# EAGLE design Saturn (EAGLE 9.6.2)
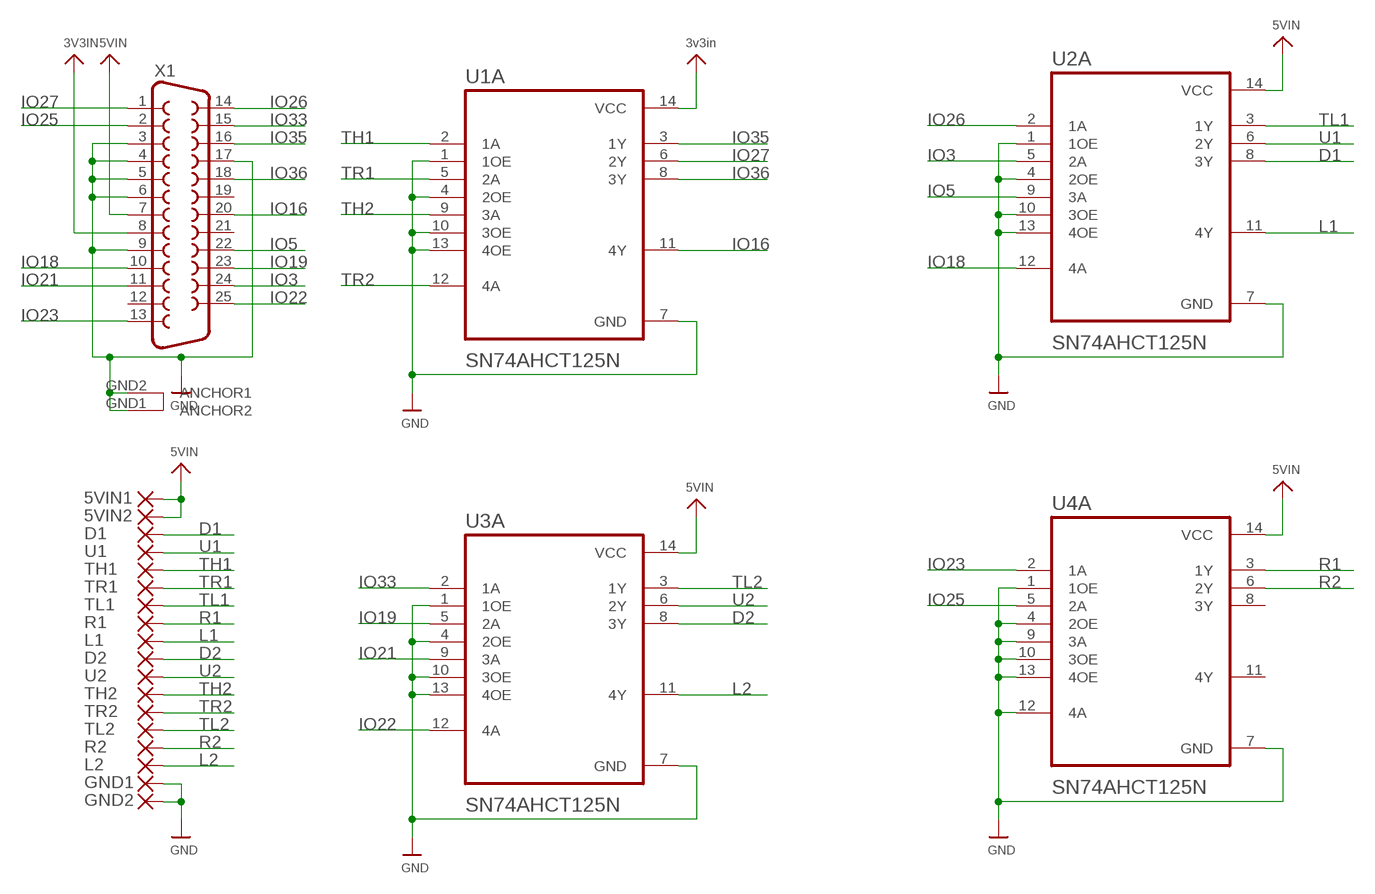
[diagram p0: schematic, sheet 1]

## Parts
5VIN1  SMD5  [SMD2,54-5,08]
5VIN2  SMD5  [SMD2,54-5,08]
D1  SMD5  [SMD2,54-5,08]
D2  SMD5  [SMD2,54-5,08]
GND1  SMD5  [SMD2,54-5,08]
GND2  SMD5  [SMD2,54-5,08]
L1  SMD5  [SMD2,54-5,08]
L2  SMD5  [SMD2,54-5,08]
R1  SMD5  [SMD2,54-5,08]
R2  SMD5  [SMD2,54-5,08]
TH1  SMD5  [SMD2,54-5,08]
TH2  SMD5  [SMD2,54-5,08]
TL1  SMD5  [SMD2,54-5,08]
TL2  SMD5  [SMD2,54-5,08]
TR1  SMD5  [SMD2,54-5,08]
TR2  SMD5  [SMD2,54-5,08]
U1  SMD5  [SMD2,54-5,08]
U1A  SN74AHCT125N  [DIP794W45P254L1969H508Q14]
U2  SMD5  [SMD2,54-5,08]
U2A  SN74AHCT125N  [DIP794W45P254L1969H508Q14]
U3A  SN74AHCT125N  [DIP794W45P254L1969H508Q14]
U4A  SN74AHCT125N  [DIP794W45P254L1969H508Q14]
X1  DB25_FEMALEHP  [F25HP]

## Nets
3V3IN: U1A.14(VCC) X1.8 ; supply symbol labelled 3v3in
5VIN: 5VIN1.1(P) 5VIN2.1(P) U2A.14(VCC) U3A.14(VCC) U4A.14(VCC) X1.7
D1: D1.1(P) U2A.8(3Y)
D2: D2.1(P) U3A.8(3Y)
GND: GND1.1(P) GND2.1(P) U1A.1(1OE) U1A.4(2OE) U1A.7(GND) U1A.10(3OE) U1A.13(4OE) U2A.1(1OE) U2A.4(2OE) U2A.7(GND) U2A.10(3OE) U2A.13(4OE) U3A.1(1OE) U3A.4(2OE) U3A.7(GND) U3A.10(3OE) U3A.13(4OE) U4A.1(1OE) U4A.4(2OE) U4A.7(GND) U4A.9(3A) U4A.10(3OE) U4A.12(4A) U4A.13(4OE) X1.3 X1.4 X1.5 X1.6 X1.9 X1.17 X1.GND1(ANCHOR2) X1.GND2(ANCHOR1)
IO3: U2A.5(2A) X1.24
IO5: U2A.9(3A) X1.22
IO16: U1A.11(4Y) X1.20
IO18: U2A.12(4A) X1.10
IO19: U3A.5(2A) X1.23
IO21: U3A.9(3A) X1.11
IO22: U3A.12(4A) X1.25
IO23: U4A.2(1A) X1.13
IO25: U4A.5(2A) X1.2
IO26: U2A.2(1A) X1.14
IO27: U1A.6(2Y) X1.1
IO33: U3A.2(1A) X1.15
IO35: U1A.3(1Y) X1.16
IO36: U1A.8(3Y) X1.18
L1: L1.1(P) U2A.11(4Y)
L2: L2.1(P) U3A.11(4Y)
R1: R1.1(P) U4A.3(1Y)
R2: R2.1(P) U4A.6(2Y)
TH1: TH1.1(P) U1A.2(1A)
TH2: TH2.1(P) U1A.9(3A)
TL1: TL1.1(P) U2A.3(1Y)
TL2: TL2.1(P) U3A.3(1Y)
TR1: TR1.1(P) U1A.5(2A)
TR2: TR2.1(P) U1A.12(4A)
U1: U1.1(P) U2A.6(2Y)
U2: U2.1(P) U3A.6(2Y)
Unconnected: U4A.8(3Y) U4A.11(4Y) X1.12 X1.19 X1.21

## Library data of the parts
5VIN1 5VIN2 D1 D2 GND1 GND2 L1 L2 R1 R2 TH1 TH2 TL1 TL2 TR1 TR2 U1 U2 = wirepad:SMD5: SMD PAD
U1A U2A U3A U4A = SN74AHCT125N:SN74AHCT125N: None Check prices <https://pricing.snapeda.com/parts/SN74AHCT125N/Texas%20Instruments/view-part?ref=eda>; AVAILABILITY: In Stock; DESCRIPTION: Quadruple Bus Buffer Gates With 3-State Outputs 14-PDIP -40 to 125; MF: Texas Instruments; MP: SN74AHCT125N; PACKAGE: PDIP-14 Texas Instruments; PRICE: None; PURCHASE-URL: https://pricing.snapeda.com/search/part/SN74AHCT125N/?ref=eda
X1 = SparkFun-Retired:DB25_FEMALE: 25 Pin male connector. PCB edge mount for regular PCB thicknesses. This connector will connect directly to the back of a PC parallel port or through a normal DB25 extension cable (M/F). SKU: PRT-08287

## Board
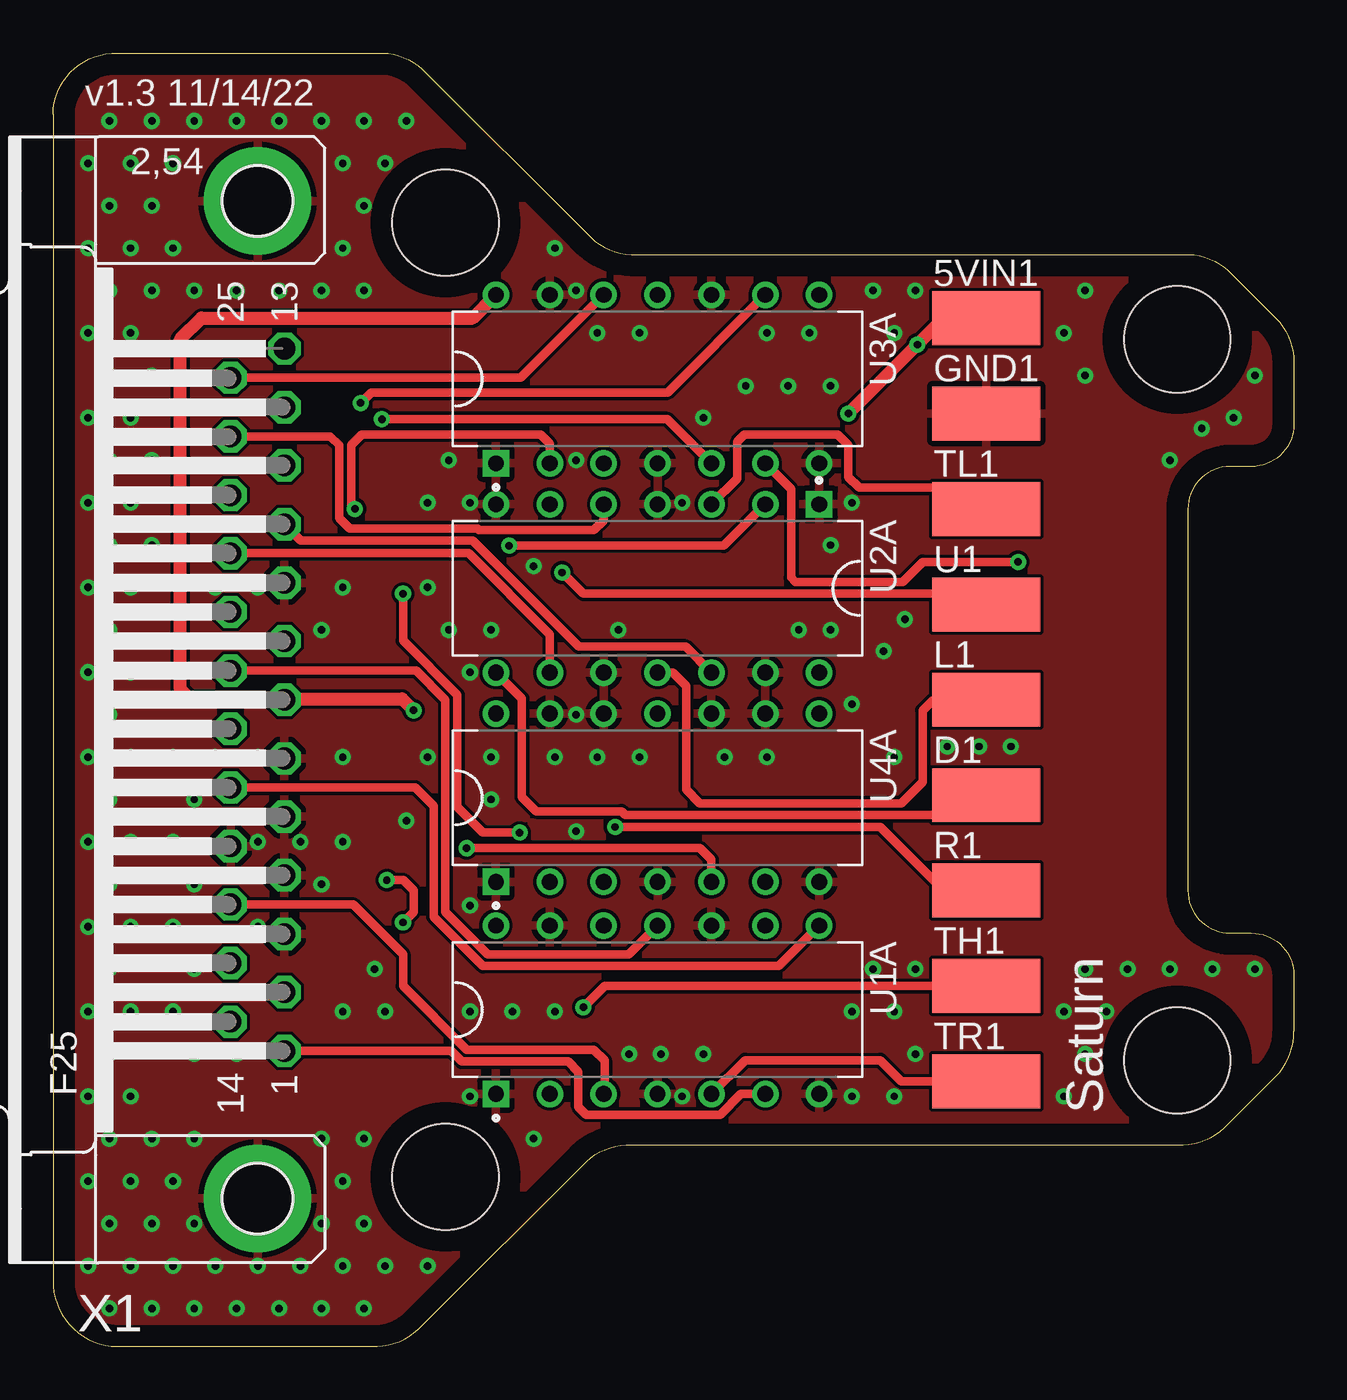
[diagram p1: board, top side]
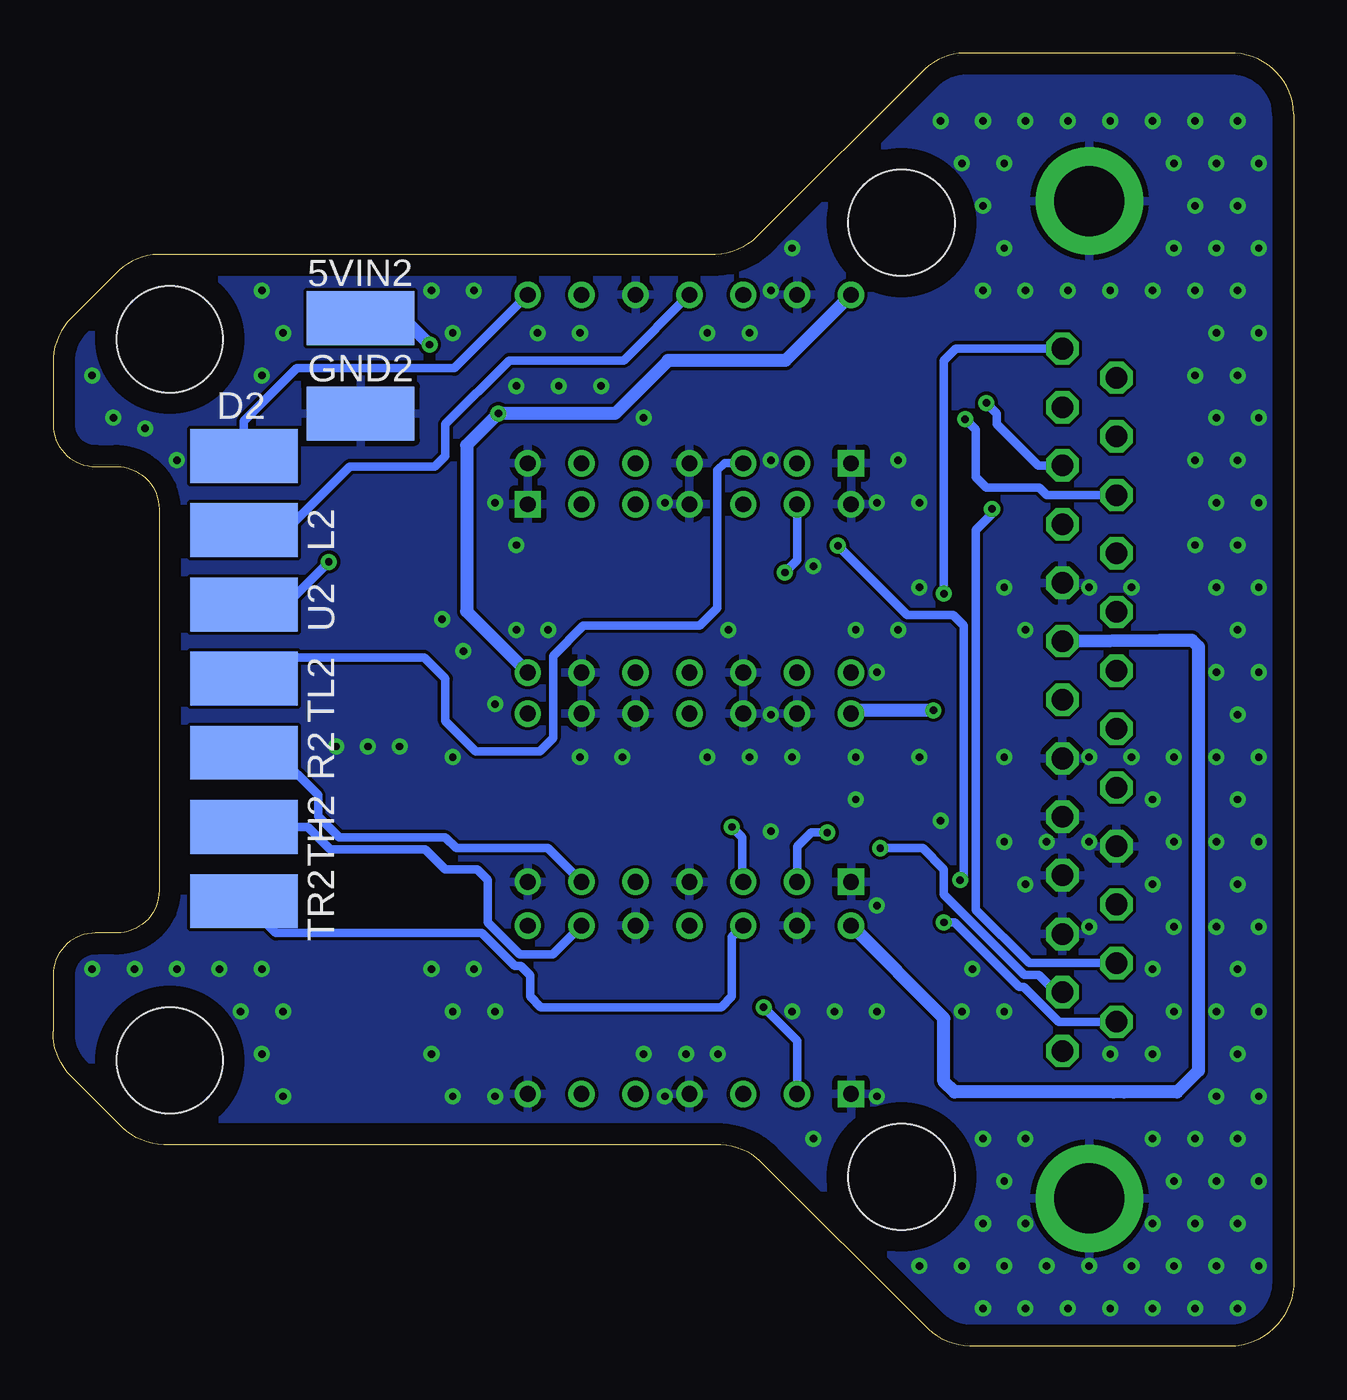
[diagram p2: board, bottom side, seen from below]

Size 58.5 x 61 mm. Coordinates in mm from the lower left corner, seen from the top.
Outline: 0,58.12 0,3.12 arc90 3.03,0 15.29,0 arc45 17.41,1 25.15,8.74 arc-45 27.27,9.5 53.29,9.5 arc45 55.41,10.5 57.65,12.74 arc45 58.5,14.86 58.5,17.5 arc90 56.5,19.5 55.5,19.5 arc-90 53.5,21.5 53.5,39.5 arc-90 55.5,41.5 56.5,41.5 arc90 58.5,43.5 58.5,46.38 arc45 57.65,48.5 55.41,50.74 arc45 53.29,51.5 27.27,51.5 arc-45 25.15,52.5 17.41,60.24 arc45 15.29,61 3.03,61 arc90 0,58.12
Copper layers (1*16): Top 0.035mm / dielectric 1.5mm / Bottom 0.035mm
Design rules "default": minimum track width 6mil, minimum drill 0.35mm, track to track 6mil, track to pad 6mil, pad to pad 6mil, via to via 6mil, smd to smd 6mil, copper to edge 40mil, drill to drill 6mil, minimum pad ring 10mil, minimum via ring 8mil, stop-mask expansion 4mil, vias tented up to drill 0.5mm, thermal gap 10mil
Holes 5 mm at 53,13.5 53,47.5 18.5,53 18.5,8

### Footprints (pad centres in the part's own frame; a part is rotated, then mirrored left to right if it is on the bottom)
SMD2,54-5,08 = smd 2.54 x 5.08: 1 0,0
DIP794W45P254L1969H508Q14 = drill 0.74 pad 1.14 square: 1 -3.97,7.62 | drill 0.74 pad 1.14: 2 -3.97,5.08; 3 -3.97,2.54; 4 -3.97,0; 5 -3.97,-2.54; 6 -3.97,-5.08; 7 -3.97,-7.62; 8 3.97,-7.62; 9 3.97,-5.08; 10 3.97,-2.54; 11 3.97,0; 12 3.97,2.54; 13 3.97,5.08; 14 3.97,7.62
F25HP = drill 1.016 octagon: 1 -16.561,-1.27; 2 -13.792,-1.27; 3 -11.049,-1.27; 4 -8.28,-1.27; 5 -5.512,-1.27; 6 -2.769,-1.27; 7 0,-1.27; 8 2.769,-1.27; 9 5.512,-1.27; 10 8.28,-1.27; 11 11.049,-1.27; 12 13.792,-1.27; 13 16.561,-1.27; 14 -15.189,1.27; 15 -12.421,1.27; 16 -9.652,1.27; 17 -6.909,1.27; 18 -4.14,1.27; 19 -1.372,1.27; 20 1.372,1.27; 21 4.14,1.27; 22 6.909,1.27; 23 9.652,1.27; 24 12.421,1.27; 25 15.189,1.27 | drill 3.302 pad 5.08: GND1 -23.52,0; GND2 23.52,0

### Placement (x,y rotation side)
5VIN1  44,48.5 270 top
5VIN2  44,48.5 270 bottom
D1  44,26 270 top
D2  49.5,42 270 bottom
GND1  44,44 270 top
GND2  44,44 270 bottom
L1  44,30.5 270 top
L2  49.5,38.5 270 bottom
R1  44,21.5 270 top
R2  49.5,28 270 bottom
TH1  44,17 270 top
TH2  49.5,24.5 270 bottom
TL1  44,39.5 270 top
TL2  49.5,31.5 270 bottom
TR1  44,12.5 270 top
TR2  49.5,21 270 bottom
U1  44,35 270 top
U1A  28.5,15.88 90 top
U2  49.5,35 270 bottom
U2A  28.5,35.75 270 top
U3A  28.5,45.63 90 top
U4A  28.5,25.88 90 top
X1  9.64,30.5 90 top

### Tracks (layer width: path | path; a pad name or v marks a point on that pad's centre or on a via)
3V3IN
  Bottom 0.61: X1.8 6.31,33.31 4.81,33.31 4.5,33 4.5,13 5.5,12 8,12 8.5,12 16,12 16.5,12.5 16.5,15.47 U1A.14
5VIN  (via drill 0.35)
  Top 0.61: v17,30 16.46,30.54 10.95,30.54 X1.7 10.87,30.54 6.46,30.54 6,31 6,47.5 7,48.5 19.78,48.5 U3A.14 | 5VIN2.1 42,48.5 v40.75,47.25 v37.5,44
  Bottom 0.61: U3A.14 23.98,46.5 29.5,46.5 32,44 v37.5,44 39,42.5 39,34.66 U2A.14 | v17,30 20.73,30 U4A.14 | 5VIN2.1 42,48.5 v40.75,47.25
D1
  Top 0.406: U2A.8 22.1,30.57 22.1,25.91 22.77,25.23 26.8,25.23 26.98,25.06 43.06,25.06 D1.1
D2
  Bottom 0.406: U3A.8 39.58,46.13 47,46.13 49.5,43.63 D2.1
GND  (via drill 0.35)
  other vias: 2.66,1.8 1.66,3.8 2.66,5.8 1.66,7.8 2.66,9.8 1.66,11.8 2.66,13.8 1.66,15.8 2.66,17.8 1.66,19.8 2.66,21.8 1.66,23.8 2.66,25.8 1.66,27.8 2.66,29.8 1.66,31.8 2.66,33.8 1.66,35.8 2.66,37.8 1.66,39.8 2.66,41.8 1.66,43.8 2.66,45.8 1.66,47.8 2.66,49.8 1.66,51.8 2.66,53.8 1.66,55.8 2.66,57.8 4.66,1.8 3.66,3.8 4.66,5.8 3.66,7.8 4.66,9.8 3.66,11.8 3.66,15.8 3.66,19.8 3.66,23.8 3.66,27.8 3.66,31.8 3.66,35.8 4.66,37.8 3.66,39.8 4.66,41.8 3.66,43.8 4.66,45.8 3.66,47.8 4.66,49.8 3.66,51.8 4.66,53.8 3.66,55.8 4.66,57.8 6.66,1.8 5.66,3.8 6.66,5.8 5.66,7.8 6.66,9.8 6.66,13.8 5.66,15.8 6.66,17.8 5.66,19.8 6.66,21.8 5.66,23.8 6.66,25.8 5.66,27.8 6.66,49.8 5.66,51.8 5.66,55.8 6.66,57.8 8.66,1.8 7.66,3.8 8.66,13.8 7.66,27.8 7.66,35.8 8.66,49.8 8.66,57.8 10.66,1.8 9.66,3.8 9.66,19.8 9.66,23.8 9.66,27.8 9.66,35.8 10.66,49.8 10.66,57.8 12.66,1.8 11.66,3.8 12.66,5.8 12.66,9.8 12.66,21.8 11.66,23.8 12.66,33.8 12.66,49.8 12.66,57.8 14.66,1.8 13.66,3.8 14.66,5.8 13.66,7.8 14.66,9.8 13.66,15.8 15.16,17.8 13.66,23.8 13.66,27.8 13.66,35.8 14.66,49.8 13.66,51.8 14.66,53.8 13.66,55.8 14.66,57.8 15.66,3.8 15.66,15.8 16.66,24.8 15.66,55.8 16.66,57.8 17.66,3.8 17.66,27.8 18.66,33.8 17.66,35.8 17.66,39.8 18.66,41.8 19.66,11.8 19.66,15.8 19.66,20.8 20.66,25.8 20.66,27.8 19.66,31.8 20.66,33.8 19.66,39.8 22.66,9.8 21.66,15.8 23.66,15.8 40.16,34.3 24.66,24.3 23.66,27.8 24.66,29.8 22.66,36.8 24.66,41.8 24.66,49.8 23.66,51.8 27.16,13.8 25.66,27.8 26.66,33.8 25.66,47.8 28.66,13.8 27.66,27.8 27.66,47.8 29.66,11.8 30.66,13.8 39.16,32.8 29.66,39.8 30.66,43.8 31.66,27.8 32.66,45.3 37.66,30.3 33.66,27.8 35.16,33.8 34.66,45.3 33.66,47.8 36.66,33.8 36.66,37.8 36.66,45.3 35.66,47.8 37.66,11.8 37.66,15.8 38.66,17.8 37.66,39.8 38.66,49.8 39.66,11.8 40.66,13.8 39.66,15.8 40.66,17.8 39.66,27.8 39.66,47.8 40.66,49.8 42.16,28.3 43.66,28.3 45.16,28.3 47.66,11.8 48.66,13.8 47.66,15.8 48.66,17.8 48.66,45.8 47.66,47.8 48.66,49.8 49.66,15.8 50.66,17.8 52.66,17.8 52.66,41.8 54.16,43.3 54.66,17.8 56.66,17.8 55.66,43.8 56.66,45.8
  pour Bottom: 0,0 0,61.12 28.53,61.12 28.53,51.62 59.03,51.62 59.03,9.5 28.03,9.5 28.03,0
  pour Top: 0,0 0,61.12 28.53,61.12 28.53,51.62 59.03,51.62 59.03,9.5 28.03,9.5 28.03,0
IO3
  Top 0.406: U2A.5 25.96,38.96 25.5,38.5 20.08,38.5 20.01,38.57 14,38.57 13.5,39.07 13.5,42.5 13.08,42.92 X1.24
IO5
  Top 0.406: U2A.9 23.42,33.58 19.59,37.41 X1.22
IO16
  Top 0.406: U1A.11 27.15,18.5 20.5,18.5 18.5,20.5 18.5,30.5 17.13,31.87 X1.20
IO18
  Top 0.406: U2A.12 29.82,33 24.79,33 19.78,38.01 11.68,38.01 X1.10
IO19  (via drill 0.35)
  Top 0.406: U3A.5 28.96,43.73 v15.5,43.73
  Bottom 0.406: v15.5,43.73 15,43.23 15,41 14.5,40.5 12,40.5 11.65,40.15 X1.23
IO21  (via drill 0.35)
  Top 0.406: U3A.9 28.98,44.99 14.99,44.99 v14.5,44.5
  Bottom 0.406: v14.5,44.5 14,44 14,43.5 12.05,41.55 X1.11
IO22
  Top 0.406: X1.25 22.05,45.69 U3A.12
IO23  (via drill 0.35)
  Top 0.406: v22,24.23 20.27,24.23 19.06,25.44 19.06,30.73 16.5,33.29 v16.5,35.5
  Bottom 0.406: v16.5,35.5 16.5,46.5 15.94,47.06 X1.13 | v22,24.23 22.77,24.23 23.42,23.58 U4A.2
IO25  (via drill 0.35)
  Top 0.406: U4A.5 31.04,22.96 30.5,23.5 v19.5,23.5
  Bottom 0.406: v19.5,23.5 17.5,23.5 16.5,22.5 16.5,21.31 12.71,17.52 12.02,17.52 11.21,16.71 X1.2
IO26  (via drill 0.35)
  Top 0.406: U2A.2 31.62,37.77 v21.5,37.77 | v15.73,22 16.5,22 17,21.5 17,20.5 v16.5,20
  Bottom 0.406: v21.5,37.77 18.23,34.5 16.06,34.5 15.56,34 15.56,22.18 v15.73,22 | X1.14 11.09,15.31 12.74,16.96 12.94,16.96 15.98,20 v16.5,20
IO27
  Top 0.406: U1A.6 32.42,11.91 31.45,10.93 25.14,10.93 24.77,11.3 24.77,12.95 24.28,13.44 19.27,13.44 18.77,13.94 X1.1
IO33  (via drill 0.35)
  Top 0.406: U3A.2 23.42,42.58 23,43 14.56,43 14.06,42.5 14.06,39.67 v14.23,39.5
  Bottom 0.406: v14.23,39.5 14.23,39.27 15,38.5 15,20.6 12.48,18.08 X1.15
IO35
  Top 0.406: U1A.3 26,11.95 26,13.5 25.5,14 19.5,14 16.5,17 16.5,18.5 14.15,20.85 X1.16
IO36
  Top 0.406: U1A.8 34.21,17.94 20.27,17.94 17.94,20.27 17.94,25.5 17.08,26.36 X1.18
L1
  Top 0.406: U2A.11 29.22,31.78 29.84,31.16 29.84,26.27 30.5,25.62 40,25.62 41,26.62 41,30 41.5,30.5 L1.1
L2
  Bottom 0.406: U3A.11 31.6,46.5 37,46.5 40,43.5 40,42 40.5,41.5 44.5,41.5 47.5,38.5 L2.1
R1  (via drill 0.35)
  Top 0.406: v26.5,24.5 39,24.5 42,21.5 R1.1
  Bottom 0.406: U4A.3 26,21.95 26,24 v26.5,24.5
R2
  Bottom 0.406: U4A.6 35.17,23.5 39.5,23.5 40,24 45,24 46,25 46,26 48,28 R2.1
TH1  (via drill 0.35)
  Top 0.406: v25,16 26,17 TH1.1
  Bottom 0.406: U1A.2 23.42,14.42 v25,16
TH2
  Bottom 0.406: U1A.9 34.93,18.5 36.5,18.5 38,20 38,22 38.5,22.5 40,22.5 40.94,23.44 45.44,23.44 46.5,24.5 TH2.1
TL1
  Top 0.406: U2A.3 32.26,40.94 32.26,42.67 32.59,43 37,43 37.5,42.5 37.5,41 38,40.5 43,40.5 TL1.1
TL2
  Bottom 0.406: U3A.3 26.84,41.66 27.18,41.32 27.18,34.82 28,34 33.5,34 34.92,32.58 34.92,28.7 35.56,28.07 38.57,28.07 40,29.5 40,31.5 41,32.5 48.5,32.5 TL2.1
TR1
  Top 0.406: U1A.5 32.63,13.5 39,13.5 40,12.5 TR1.1
TR2
  Bottom 0.406: U1A.12 26.5,19.31 26.5,16.5 27,16 35.5,16 36,16.5 36,17.5 36.44,17.94 36.73,17.94 38.29,19.5 48,19.5 TR2.1
U1  (via drill 0.35)
  Top 0.406: v24,36.5 25,35.5 43.5,35.5 U1.1
  Bottom 0.406: U2A.6 23.42,37.08 v24,36.5
U2  (via drill 0.35)
  Top 0.406: U3A.6 34.8,40.44 34.8,36.26 35,36.06 40.06,36.06 41,37 v45.5,37
  Bottom 0.406: v45.5,37 47.5,35 U2.1

### Text on the board
tPlace: v1.3 11/14/22 | Saturn